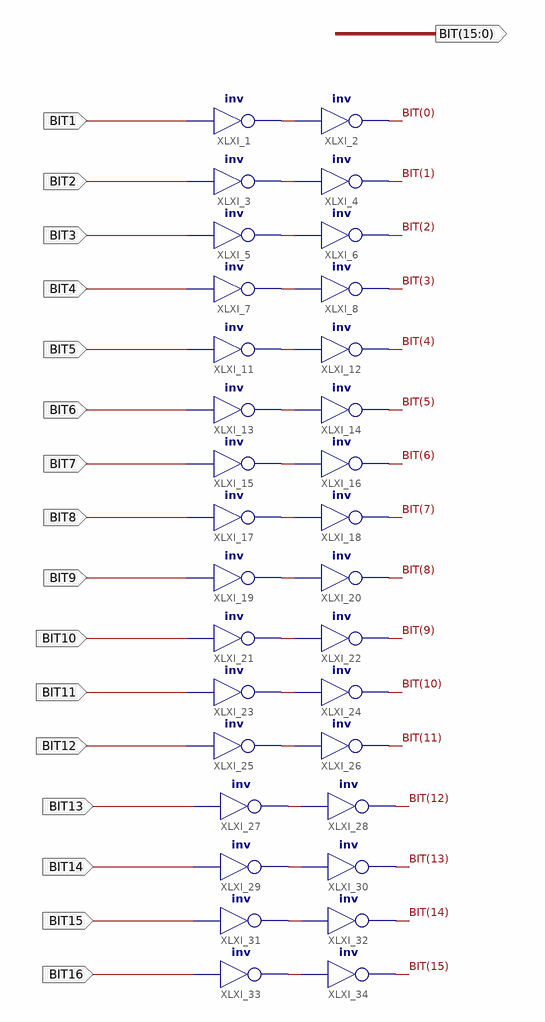
[diagram p0: schematic sheet 1]
// Xilinx ISE schematic MixBus16_1.sch (spartan6) as structural Verilog: 32 symbols, 17 ports
module MixBus16_1 (
  input  BIT1,
  input  BIT2,
  input  BIT3,
  input  BIT4,
  input  BIT5,
  input  BIT6,
  input  BIT7,
  input  BIT8,
  input  BIT9,
  input  BIT10,
  input  BIT11,
  input  BIT12,
  input  BIT13,
  input  BIT14,
  input  BIT15,
  input  BIT16,
  output [15:0] BIT
);

  wire XLXN_13, XLXN_15, XLXN_17, XLXN_19, XLXN_23, XLXN_25, XLXN_27, XLXN_29, XLXN_31, XLXN_33, XLXN_35,
       XLXN_37, XLXN_39, XLXN_41, XLXN_43, XLXN_45;

  not XLXI_1 (XLXN_13, BIT1);
  not XLXI_2 (BIT[0], XLXN_13);
  not XLXI_3 (XLXN_15, BIT2);
  not XLXI_4 (BIT[1], XLXN_15);
  not XLXI_5 (XLXN_17, BIT3);
  not XLXI_6 (BIT[2], XLXN_17);
  not XLXI_7 (XLXN_19, BIT4);
  not XLXI_8 (BIT[3], XLXN_19);
  not XLXI_11 (XLXN_23, BIT5);
  not XLXI_12 (BIT[4], XLXN_23);
  not XLXI_13 (XLXN_25, BIT6);
  not XLXI_14 (BIT[5], XLXN_25);
  not XLXI_15 (XLXN_27, BIT7);
  not XLXI_16 (BIT[6], XLXN_27);
  not XLXI_17 (XLXN_29, BIT8);
  not XLXI_18 (BIT[7], XLXN_29);
  not XLXI_19 (XLXN_31, BIT9);
  not XLXI_20 (BIT[8], XLXN_31);
  not XLXI_21 (XLXN_33, BIT10);
  not XLXI_22 (BIT[9], XLXN_33);
  not XLXI_23 (XLXN_35, BIT11);
  not XLXI_24 (BIT[10], XLXN_35);
  not XLXI_25 (XLXN_37, BIT12);
  not XLXI_26 (BIT[11], XLXN_37);
  not XLXI_27 (XLXN_39, BIT13);
  not XLXI_28 (BIT[12], XLXN_39);
  not XLXI_29 (XLXN_41, BIT14);
  not XLXI_30 (BIT[13], XLXN_41);
  not XLXI_31 (XLXN_43, BIT15);
  not XLXI_32 (BIT[14], XLXN_43);
  not XLXI_33 (XLXN_45, BIT16);
  not XLXI_34 (BIT[15], XLXN_45);
endmodule
